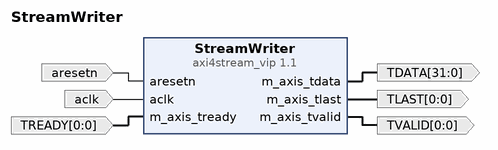
[diagram p0: block diagram of the top level]
# Vivado block design StreamWriter, xc7z010clg400-1, Vivado 2019.2.1
create_bd_design StreamWriter

create_bd_port -dir I -type rst aresetn
create_bd_port -dir I -type clk aclk
set_property -dict {CONFIG.ASSOCIATED_RESET aresetn CONFIG.FREQ_HZ 125000000} [get_bd_ports aclk]
create_bd_port -dir O -from 31 -to 0 TDATA
create_bd_port -dir O -from 0 -to 0 TLAST
create_bd_port -dir I -from 0 -to 0 TREADY
create_bd_port -dir O -from 0 -to 0 TVALID

create_bd_cell -type ip -vlnv xilinx.com:ip:axi4stream_vip:1.1 StreamWriter
set_property -dict [list \
  CONFIG.HAS_TKEEP 0 \
  CONFIG.HAS_TLAST 1 \
  CONFIG.HAS_TREADY 1 \
  CONFIG.HAS_TSTRB 0 \
  CONFIG.INTERFACE_MODE MASTER \
  CONFIG.TDATA_NUM_BYTES 4 \
  CONFIG.TDEST_WIDTH 0 \
  CONFIG.TID_WIDTH 0 \
  CONFIG.TUSER_WIDTH 0 \
] [get_bd_cells StreamWriter]

# ---- connections ----

connect_bd_net -net aresetn_0_1 [get_bd_ports aresetn] [get_bd_pins StreamWriter/aresetn]
connect_bd_net -net aclk_0_1 [get_bd_ports aclk] [get_bd_pins StreamWriter/aclk]
connect_bd_net [get_bd_pins StreamWriter/m_axis_tdata] [get_bd_ports TDATA]
connect_bd_net [get_bd_pins StreamWriter/m_axis_tlast] [get_bd_ports TLAST]
connect_bd_net -net m_axis_tready_0_1 [get_bd_ports TREADY] [get_bd_pins StreamWriter/m_axis_tready]
connect_bd_net [get_bd_pins StreamWriter/m_axis_tvalid] [get_bd_ports TVALID]

validate_bd_design
save_bd_design
